# Altium project Electrolux_ENV06_387109600_RevA_PCB.PrjPCB (part 1 of 3)
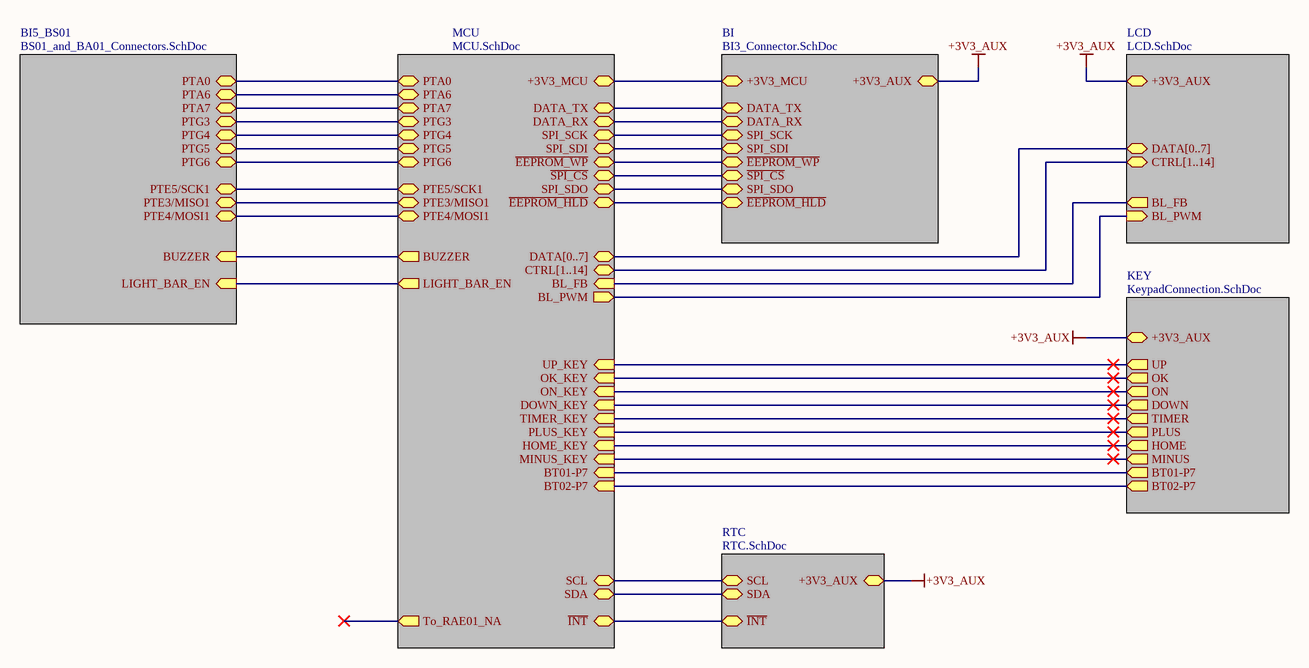
[diagram p0: Top.SchDoc]
7 sheets, 164 parts. Net scope: hierarchical (ports join the sheet entries above them; power ports are global).
Sheets:
  Top.SchDoc
    MCU = MCU.SchDoc
    BI = BI3_Connector.SchDoc
    LCD = LCD.SchDoc
    KEY = KeypadConnection.SchDoc
    RTC = RTC.SchDoc
    BI5_BS01 = BS01_and_BA01_Connectors.SchDoc

## Sheet Top.SchDoc
size A4; DocumentNumber: 1; SheetNumber: 1; SheetTotal: 7

### Sub-sheets
BI = BI3_Connector.SchDoc: DATA_TX, +3V3_MCU, +3V3_AUX, DATA_RX, SPI_SCK, SPI_SDI, ~{EEPROM_WP}, ~{SPI_CS}, SPI_SDO, ~{EEPROM_HLD}
BI5_BS01 = BS01_and_BA01_Connectors.SchDoc: PTA6 (bidir), PTA7 (bidir), PTG3 (bidir), PTG4 (bidir), PTG5 (bidir), PTG6 (bidir), PTE5/SCK1 (bidir), PTE3/MISO1 (bidir), PTE4/MOSI1 (bidir), PTA0 (bidir), LIGHT_BAR_EN (in), BUZZER (in)
KEY = KeypadConnection.SchDoc: UP (out), OK (out), ON (out), +3V3_AUX, DOWN (out), TIMER (out), PLUS (out), HOME (out), MINUS (out), BT02-P7 (out), BT01-P7 (out)
LCD = LCD.SchDoc: +3V3_AUX, BL_FB (out), BL_PWM (in), CTRL[1..14], DATA[0..7]
MCU = MCU.SchDoc: DATA_TX, DATA_RX, SPI_SCK, SPI_SDI, ~{EEPROM_WP}, ~{SPI_CS}, SPI_SDO, +3V3_MCU, UP_KEY (in), OK_KEY (in), ON_KEY (in), DOWN_KEY (in), TIMER_KEY (in), PLUS_KEY (in), HOME_KEY (in), MINUS_KEY (in), ~{EEPROM_HLD}, SCL, SDA, ~{INT}, BL_PWM (out), BL_FB (in), BT01-P7 (in), BT02-P7 (in), CTRL[1..14], DATA[0..7], LIGHT_BAR_EN (out), BUZZER (out), To_RAE01_NA (out), PTA6 (bidir), PTA7 (bidir), PTG3 (bidir), PTG4 (bidir), PTG5 (bidir), PTG6 (bidir), PTE5/SCK1 (bidir), PTE3/MISO1 (bidir), PTE4/MOSI1 (bidir), PTA0 (bidir)
RTC = RTC.SchDoc: +3V3_AUX, SCL, SDA, ~{INT}

### Nets
+3V3_AUX: sheet BI/+3V3_AUX, sheet LCD/+3V3_AUX, sheet KEY/+3V3_AUX, sheet RTC/+3V3_AUX
IRQ: sheet MCU/~{INT}, sheet RTC/~{INT}
PTA0: sheet MCU/PTA0, sheet BI5_BS01/PTA0
PTA6: sheet MCU/PTA6, sheet BI5_BS01/PTA6
PTA7: sheet MCU/PTA7, sheet BI5_BS01/PTA7
PTG3: sheet MCU/PTG3, sheet BI5_BS01/PTG3
PTG4: sheet MCU/PTG4, sheet BI5_BS01/PTG4
PTG5: sheet MCU/PTG5, sheet BI5_BS01/PTG5
PTG6: sheet MCU/PTG6, sheet BI5_BS01/PTG6
VDD: sheet MCU/+3V3_MCU, sheet BI/+3V3_MCU
NetBT01_3: sheet MCU/ON_KEY, sheet KEY/ON
NetBT01_4: sheet MCU/UP_KEY, sheet KEY/UP
NetBT01_5: sheet MCU/DOWN_KEY, sheet KEY/DOWN
NetBT01_6: sheet MCU/HOME_KEY, sheet KEY/HOME
NetBT01_7: sheet MCU/BT01-P7, sheet KEY/BT01-P7
NetBT02_3: sheet MCU/TIMER_KEY, sheet KEY/TIMER
NetBT02_4: sheet MCU/PLUS_KEY, sheet KEY/PLUS
NetBT02_5: sheet MCU/MINUS_KEY, sheet KEY/MINUS
NetBT02_6: sheet MCU/OK_KEY, sheet KEY/OK
NetBT02_7: sheet MCU/BT02-P7, sheet KEY/BT02-P7
NetCD17_1: sheet MCU/BL_FB, sheet LCD/BL_FB
NetQI02_3: sheet MCU/DATA_RX, sheet BI/DATA_RX
NetRA07_2: sheet MCU/PTE3/MISO1, sheet BI5_BS01/PTE3/MISO1
NetRA10_2: sheet MCU/PTE4/MOSI1, sheet BI5_BS01/PTE4/MOSI1
NetRA12_2: sheet MCU/PTE5/SCK1, sheet BI5_BS01/PTE5/SCK1
NetRB05_1: sheet MCU/BUZZER, sheet BI5_BS01/BUZZER
NetRD17_2: sheet MCU/BL_PWM, sheet LCD/BL_PWM
NetRI09_1: sheet MCU/DATA_TX, sheet BI/DATA_TX
NetRL02_2: sheet MCU/LIGHT_BAR_EN, sheet BI5_BS01/LIGHT_BAR_EN
NetRM01_1: sheet MCU/~{EEPROM_WP}, sheet BI/~{EEPROM_WP}
NetRM02_1: sheet MCU/~{EEPROM_HLD}, sheet BI/~{EEPROM_HLD}
NetRM03_1: sheet MCU/~{SPI_CS}, sheet BI/~{SPI_CS}
NetRM04_2: sheet MCU/SPI_SCK, sheet BI/SPI_SCK
NetRM05_2: sheet MCU/SPI_SDI, sheet BI/SPI_SDI
NetRM06_2: sheet MCU/SPI_SDO, sheet BI/SPI_SDO
NetRR01_1: sheet MCU/SDA, sheet RTC/SDA
NetRR02_1: sheet MCU/SCL, sheet RTC/SCL

### Buses and harness runs
bus sheet LCD/CTRL[1..14] = sheet MCU/CTRL[1..14]
bus sheet LCD/DATA[0..7] = sheet MCU/DATA[0..7]

### Notes on the sheet
- Title
- Size:
- Date:
- A4
- Number:
- Time:
- Revision:
- Sheet
- of
- File:

## Sheet MCU.SchDoc
size A3; DocumentNumber: 6; SheetNumber: 6; SheetTotal: 7
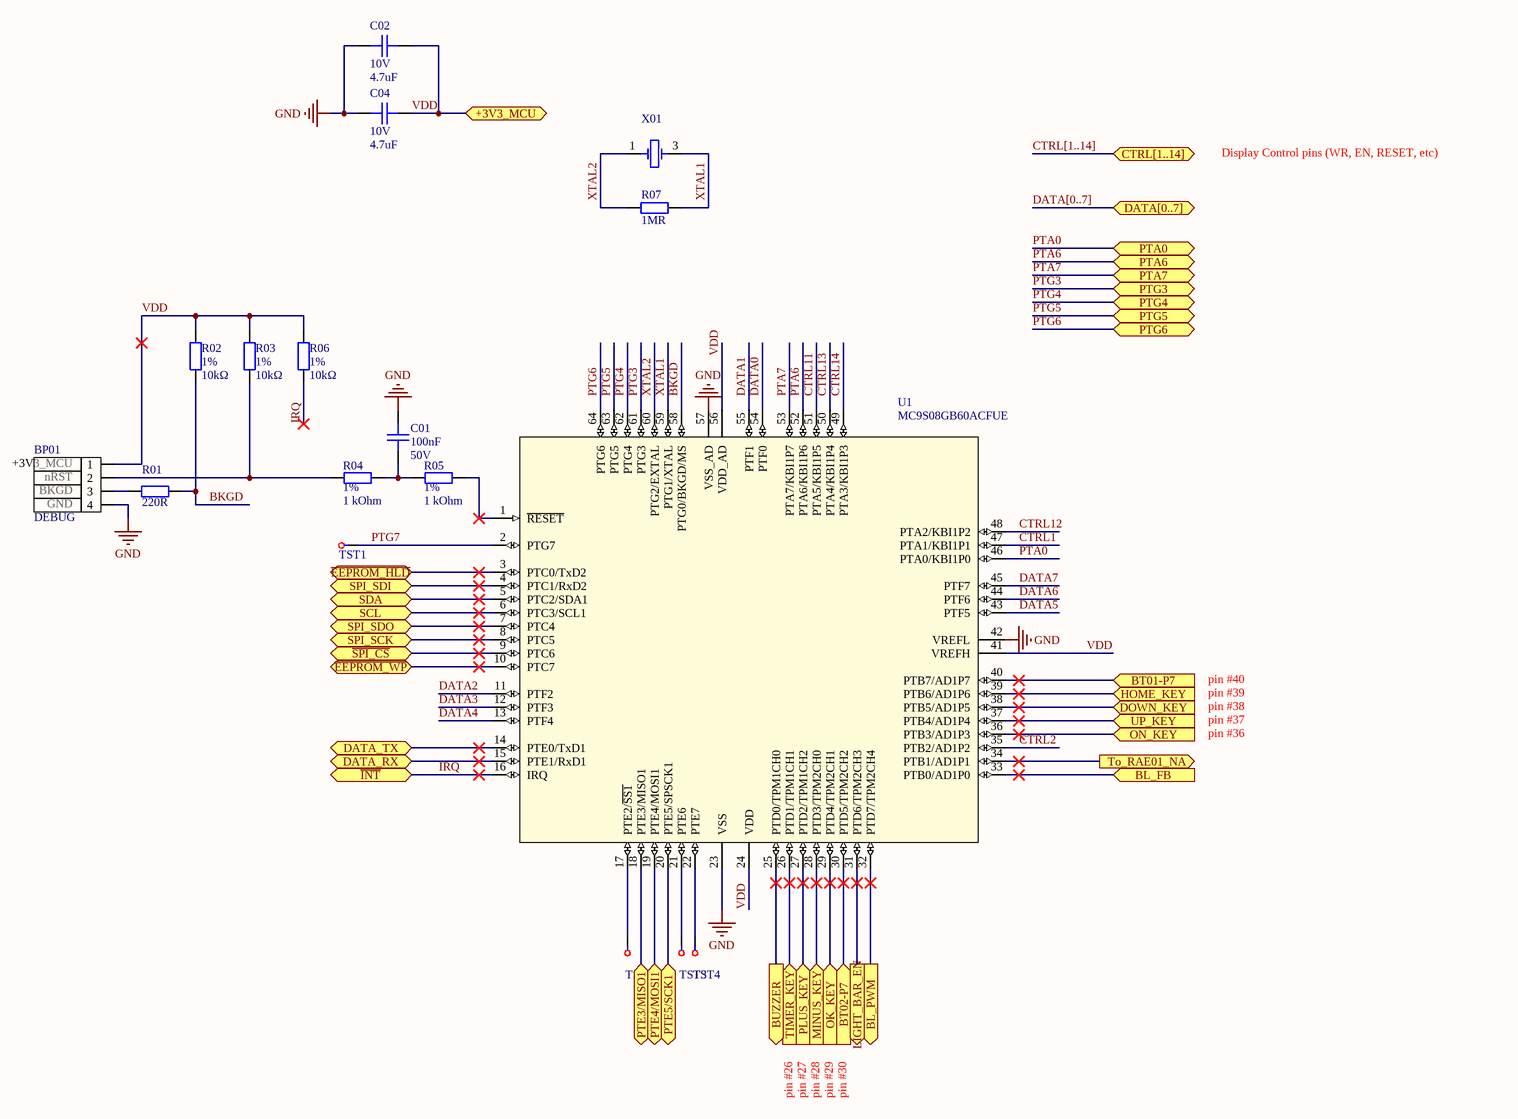
[diagram p1: MCU.SchDoc]

### Parts
BP01  DEBUG  pin_1: +3V3_MCU  pin_2: nRST  pin_3: BKGD  pin_4: GND
C01  Capacitance: 100nF  Voltage Rating: 50V  [CAPC1608X08N_0603]  (hidden comment: CAP CER 0.1uF ±10% 50V X7R 0603)
C02  Voltage Rating: 10V  Capacitance: 4.7uF  [0603C]  (hidden comment: CAP CER 4.7UF 10V X5R 0603)
C04  Voltage Rating: 10V  Capacitance: 4.7uF  [0603C]  (hidden comment: CAP CER 4.7UF 10V X5R 0603)
R01  Resistance: 220R  [Resistor-0603]  (hidden comment: R 220Ω ±1% 0603 0.1W)
R02  Tolerance: 1%  Resistance: 10kΩ  [R0603]  (hidden comment: 10 kOhms ±1% 0.1W, 1/10W Chip Resistor 0603 (1608 Metric)  Thick Film)
R03  Tolerance: 1%  Resistance: 10kΩ  [R0603]  (hidden comment: 10 kOhms ±1% 0.1W, 1/10W Chip Resistor 0603 (1608 Metric)  Thick Film)
R04  Tolerance: 1%  Resistance: 1 kOhm  [R0603]  (hidden comment: 1 kOhms ±1% 0.1W, 1/10W Chip Resistor 0603 (1608 Metric) Moisture Resistant Thick Film)  (no BOM)
R05  Tolerance: 1%  Resistance: 1 kOhm  [R0603]  (hidden comment: 1 kOhms ±1% 0.1W, 1/10W Chip Resistor 0603 (1608 Metric) Moisture Resistant Thick Film)  (no BOM)
R06  Tolerance: 1%  Resistance: 10kΩ  [R0603]  (hidden comment: 10 kOhms ±1% 0.1W, 1/10W Chip Resistor 0603 (1608 Metric)  Thick Film)
R07  Resistance: 1MR  [Resistor-0603]  (hidden comment: Resistor)
TST1  TestPoint  [Testpoint]  (value not drawn)  (no BOM)
TST2  TestPoint  [Testpoint]  (value not drawn)  (no BOM)
TST3  TestPoint  [Testpoint]  (value not drawn)  (no BOM)
TST4  TestPoint  [Testpoint]  (value not drawn)  (no BOM)
U1  MC9S08GB60ACFUE
X01  ABM11-16.000MHZ-D2X-T3  [ABM11]  (value not drawn)

### Ports
+3V3_MCU, BL_FB (in), BL_PWM (out), BT01-P7 (in), BT02-P7 (in), BUZZER (out), CTRL[1..14], DATA[0..7], DATA_RX, DATA_TX, DOWN_KEY (in), HOME_KEY (in), LIGHT_BAR_EN (out), MINUS_KEY (in), OK_KEY (in), ON_KEY (in), PLUS_KEY (in), PTA0 (bidir), PTA6 (bidir), PTA7 (bidir), PTE3/MISO1 (bidir), PTE4/MOSI1 (bidir), PTE5/SCK1 (bidir), PTG3 (bidir), PTG4 (bidir), PTG5 (bidir), PTG6 (bidir), SCL, SDA, SPI_SCK, SPI_SDI, SPI_SDO, TIMER_KEY (in), To_RAE01_NA (out), UP_KEY (in), ~{EEPROM_HLD}, ~{EEPROM_WP}, ~{INT}, ~{SPI_CS}

### Nets
D_GND: X01.2(GND) X01.4(GND)
GND: BP01.4 C01.2 C02.1 C04.1 U1.23(VSS) U1.42(VREFL) U1.57(VSS_AD)
BKGD: R01.2 R02.1 U1.58(PTG0/BKGD/MS)
CTRL1: U1.47(PTA1/KBI1P1)
CTRL2: U1.35(PTB2/AD1P2)
CTRL11: U1.51(PTA5/KBI1P5)
CTRL12: U1.48(PTA2/KBI1P2)
CTRL13: U1.50(PTA4/KBI1P4)
CTRL14: U1.49(PTA3/KBI1P3)
DATA0: U1.54(PTF0)
DATA1: U1.55(PTF1)
DATA2: U1.11(PTF2)
DATA3: U1.12(PTF3)
DATA4: U1.13(PTF4)
DATA5: U1.43(PTF5)
DATA6: U1.44(PTF6)
DATA7: U1.45(PTF7)
IRQ: R06.1 U1.16(IRQ) ; port ~{INT}
PTA0: U1.46(PTA0/KBI1P0) ; port PTA0
PTA6: U1.52(PTA6/KBI1P6) ; port PTA6
PTA7: U1.53(PTA7/KBI1P7) ; port PTA7
PTG3: U1.61(PTG3) ; port PTG3
PTG4: U1.62(PTG4) ; port PTG4
PTG5: U1.63(PTG5) ; port PTG5
PTG6: U1.64(PTG6) ; port PTG6
PTG7: TST1.1 U1.2(PTG7)
VDD: BP01.1 C02.2 C04.2 R02.2 R03.2 R06.2 U1.24(VDD) U1.41(VREFH) U1.56(VDD_AD) ; port +3V3_MCU
XTAL1: R07.2 U1.59(PTG1/XTAL) X01.3(OSC2)
XTAL2: R07.1 U1.60(PTG2/EXTAL) X01.1(OSC1)
NetBP01_2: BP01.2 R03.1 R04.1
NetBP01_3: BP01.3 R01.1
NetBT01_3: U1.36(PTB3/AD1P3) ; port ON_KEY
NetBT01_4: U1.37(PTB4/AD1P4) ; port UP_KEY
NetBT01_5: U1.38(PTB5/AD1P5) ; port DOWN_KEY
NetBT01_6: U1.39(PTB6/AD1P6) ; port HOME_KEY
NetBT01_7: U1.40(PTB7/AD1P7) ; port BT01-P7
NetBT02_3: U1.26(PTD1/TPM1CH1) ; port TIMER_KEY
NetBT02_4: U1.27(PTD2/TPM1CH2) ; port PLUS_KEY
NetBT02_5: U1.28(PTD3/TPM2CH0) ; port MINUS_KEY
NetBT02_6: U1.29(PTD4/TPM2CH1) ; port OK_KEY
NetBT02_7: U1.30(PTD5/TPM2CH2) ; port BT02-P7
NetC01_1: C01.1 R04.2 R05.1
NetCD17_1: U1.33(PTB0/AD1P0) ; port BL_FB
NetQI02_3: U1.15(PTE1/RxD1) ; port DATA_RX
NetR05_2: R05.2 U1.1(~{RESET})
NetRA07_2: U1.18(PTE3/MISO1) ; port PTE3/MISO1
NetRA10_2: U1.19(PTE4/MOSI1) ; port PTE4/MOSI1
NetRA12_2: U1.20(PTE5/SPSCK1) ; port PTE5/SCK1
NetRB05_1: U1.25(PTD0/TPM1CH0) ; port BUZZER
NetRD17_2: U1.32(PTD7/TPM2CH4) ; port BL_PWM
NetRI09_1: U1.14(PTE0/TxD1) ; port DATA_TX
NetRL02_2: U1.31(PTD6/TPM2CH3) ; port LIGHT_BAR_EN
NetRM01_1: U1.10(PTC7) ; port ~{EEPROM_WP}
NetRM02_1: U1.3(PTC0/TxD2) ; port ~{EEPROM_HLD}
NetRM03_1: U1.9(PTC6) ; port ~{SPI_CS}
NetRM04_2: U1.8(PTC5) ; port SPI_SCK
NetRM05_2: U1.4(PTC1/RxD2) ; port SPI_SDI
NetRM06_2: U1.7(PTC4) ; port SPI_SDO
NetRR01_1: U1.5(PTC2/SDA1) ; port SDA
NetRR02_1: U1.6(PTC3/SCL1) ; port SCL
NetTST2_1: TST2.1 U1.17(PTE2/~{SS1})
NetTST3_1: TST3.1 U1.21(PTE6)
NetTST4_1: TST4.1 U1.22(PTE7)
NetU1_34: U1.34(PTB1/AD1P1) ; port To_RAE01_NA

### Buses and harness runs
bus CTRL[1..14] = port CTRL[1..14]
bus DATA[0..7] = port DATA[0..7]

### Notes on the sheet
- Display Control pins (WR, EN, RESET, etc)
- pin #40
- pin #39
- pin #38
- pin #37
- pin #36
- pin #26
- pin #27
- pin #28
- pin #29
- pin #30
- Title
- Size:
- Date:
- A3
- Number:
- Time:
- Revision:
- Sheet
- of
- File:

### Library data of the parts
BP01 = CONN HEADER 4POS
C01 = CAP CER 0.1uF ±10% 50V X7R 0603: Capacitor; Manufacturer: KEMET; Manufacturer Part Number: C0603C104M5RACTU; Dielectric Material: Ceramic; Tolerance: 20%; Dissipation Factor: 2.5%; Supplier 1: Digi-Key; Stock 1: 1202175; Pricing 1: 1=0.1, 10=0.039, 50=0.0204, 100=0.0174, 500=0.0124, 1000=0.0097 (USD); Mount: Surface Mount,PCB; Case/Package: 0603; Case Code (Metric): 1608; Case Code (Imperial): 0603; Contact Plating: Tin,Matte; Min Operating Temperature: -55°C; Max Operating Temperature: 125°C; Package Quantity: 1; Packaging: Tape and Reel; Voltage Rating (DC): 50V; Dielectric: X7R; Termination: SMD/SMT; Length: 1.6mm; Height: 0.8mm; Width: 0.031inch; Thickness: 0.034inch; Lead Pitch: 0.7mm; Depth: 0.8mm; Radiation Hardening: No; REACH SVHC: No SVHC; ComponentLink1URL: http://www.farnell.com/datasheets/2746056.pdf?src-supplier=Element14; ComponentLink1Description: http://www.farnell.com/datasheets/2746056.pdf?src-supplier=Element14; ComponentLink2URL: http://www.mouser.com/ds/2/212/KEM_C1002_X7R_SMD-1102033.pdf?src-supplier=Mouser; ComponentLink2Description: http://www.mouser.com/ds/2/212/KEM_C1002_X7R_SMD-1102033.pdf?src-supplier=Mouser; ComponentLink3URL: https://www.verical.com/server-webapp/html/getDatasheet?partID=626892&src-supplier=Verical; ComponentLink3Description: https://www.verical.com/server-webapp/html/getDatasheet?partID=626892&src-supplier=Verical; ComponentLink4URL: http://components.arrow.com/part/dataview/40911037S8853915N7429?src-supplier=Arrow; ComponentLink4Description: http://components.arrow.com/part/dataview/40911037S8853915N7429?src-supplier=Arrow; ComponentLink5URL: http://capacitoredge.kemet.com/capedge2/DataSheet?pn=C0603C104M5RAC7867&src-supplier=Avnet; ComponentLink5Description: http://capacitoredge.kemet.com/capedge2/DataSheet?pn=C0603C104M5RAC7867&src-supplier=Avnet; ComponentLink6URL: http://capacitoredge.kemet.com/capedge2/DataSheet?pn=C0603C104M5RAC7867&src-supplier=Avnet+Asia; ComponentLink6Description: http://capacitoredge.kemet.com/capedge2/DataSheet?pn=C0603C104M5RAC7867&src-supplier=Avnet+Asia; ComponentLink7URL: http://www.farnell.com/datasheets/2746056.pdf?src-supplier=Farnell; ComponentLink7Description: http://www.farnell.com/datasheets/2746056.pdf?src-supplier=Farnell; ComponentLink8URL: http://www.farnell.com/datasheets/2746056.pdf?src-supplier=Newark; ComponentLink8Description: http://www.farnell.com/datasheets/2746056.pdf?src-supplier=Newark; ComponentLink9URL: http://www.alliedelec.com/m/d/6f3b5eb83d09db50ed28bdc730567b33.pdf?src-supplier=Allied+Electronics; ComponentLink9Description: http://www.alliedelec.com/m/d/6f3b5eb83d09db50ed28bdc730567b33.pdf?src-supplier=Allied+Electronics; ComponentLink10URL: https://api.kemet.com/component-edge/download/datasheet/C0603C104M5RACTU.pdf?src-supplier=Digi-Key; ComponentLink10Description: https://api.kemet.com/component-edge/download/datasheet/C0603C104M5RACTU.pdf?src-supplier=Digi-Key; ComponentLink11URL: http://www.farnell.com/datasheets/2315113.pdf?src-supplier=Newark; ComponentLink11Description: http://www.farnell.com/datasheets/2315113.pdf?src-supplier=Newark; ComponentLink12URL: http://www.farnell.com/datasheets/1828800.pdf?src-supplier=Newark; ComponentLink12Description: http://www.farnell.com/datasheets/1828800.pdf?src-supplier=Newark; ComponentLink13URL: http://components.arrow.com/part/dataview/0323_00313986?src-supplier=Arrow+Europe; ComponentLink13Description: http://components.arrow.com/part/dataview/0323_00313986?src-supplier=Arrow+Europe; ComponentLink14URL: https://www.verical.com/server-webapp/html/getDatasheet?partID=110138&src-supplier=Verical; ComponentLink14Description: https://www.verical.com/server-webapp/html/getDatasheet?partID=110138&src-supplier=Verical; Supplier Part Number 1: 399-7845-1-ND
C02 C04 = CAP CER 4.7UF 10V X5R 0603: 4.7µF ±10% 10V Ceramic Capacitor X5R 0603 (1608 Metric); Manufacturer: Yageo; Manufacturer Part Number: CC0603KRX5R6BB475; Supplier 1: Digi-Key; Stock 1: 325858; Pricing 1: 1=0.26, 10=0.18, 100=0.102, 500=0.072, 1000=0.063 (USD); Mount: Surface Mount; Case Code (Imperial): 0603; Case Code (Metric): 1608; Min Operating Temperature: -55°C; Max Operating Temperature: 85°C; Voltage Rating (DC): 10V; Tolerance: 10%; Packaging: Tape and Reel; Package Quantity: 1; Dielectric: X5R; Termination: SMD/SMT; Composition: Ceramic; Length: 1.6mm; Height: 0.8mm; Width: 0.8mm; Thickness: 0.035inch; Depth: 0.8mm; Radiation Hardening: No; REACH SVHC: Unknown; Lead Free: Lead Free; Halogen Free: Halogen Free; ComponentLink1URL: http://www.farnell.com/datasheets/2167237.pdf?src-supplier=Element14; ComponentLink1Description: http://www.farnell.com/datasheets/2167237.pdf?src-supplier=Element14; ComponentLink2URL: http://www.yageo.com/documents/recent/UPY-GPHC_X5R_4V-to-50V_25.pdf?src-supplier=Digi-Key; ComponentLink2Description: http://www.yageo.com/documents/recent/UPY-GPHC_X5R_4V-to-50V_25.pdf?src-supplier=Digi-Key; ComponentLink3URL: http://www.yageo.com/documents/recent/UPY-GPHC_X5R_4V-to-50V_12.pdf?src-supplier=Avnet; ComponentLink3Description: http://www.yageo.com/documents/recent/UPY-GPHC_X5R_4V-to-50V_12.pdf?src-supplier=Avnet; ComponentLink4URL: http://www.yageo.com/documents/recent/UPY-GPHC_X5R_4V-to-50V_12.pdf?src-supplier=Avnet+Europe; ComponentLink4Description: http://www.yageo.com/documents/recent/UPY-GPHC_X5R_4V-to-50V_12.pdf?src-supplier=Avnet+Europe; Supplier Part Number 1: 311-1455-1-ND; Case/Package: 0603
R01 = R 220Ω ±1% 0603 0.1W: Resistor; Manufacturer: Stackpole Electronics; Manufacturer Part Number: RMCF0603FT220R; Power Rating: 100mW; Temperature Coefficient: 100ppm/°C; Supplier 1: Digi-Key; Stock 1: 79747; Pricing 1: 1=0.1, 10=0.016, 100=0.0065, 1000=0.0029, 2500=0.0025 (USD); Mount: Surface Mount; Case/Package: 0603; Case Code (Metric): 1608; Case Code (Imperial): 0603; Contact Plating: Tin,Matte; Min Operating Temperature: -55°C; Max Operating Temperature: 155°C; Packaging: Tape and Reel; Composition: Thick Film; Number of Terminations: 2; Max Power Dissipation: 100mW; Features: Automotive AEC-Q200; Length: 0.061inch; Height: 0.022inch; Width: 0.031inch; Radiation Hardening: No; Lead Free: Lead Free; ComponentLink1URL: http://components.arrow.com/part/dataview/50498833S229663N1174?src-supplier=Arrow; ComponentLink1Description: http://components.arrow.com/part/dataview/50498833S229663N1174?src-supplier=Arrow; ComponentLink2URL: https://www.seielect.com/catalog/SEI-Packaging.pdf?src-supplier=Digi-Key; ComponentLink2Description: https://www.seielect.com/catalog/SEI-Packaging.pdf?src-supplier=Digi-Key; ComponentLink3URL: http://www.seielect.com/Catalog/SEI-RMC.pdf?src-supplier=Future+Electronics; ComponentLink3Description: http://www.seielect.com/Catalog/SEI-RMC.pdf?src-supplier=Future+Electronics; ComponentLink4URL: https://www.seielect.com/catalog/SEI-RMCF_RMCP.pdf?src-supplier=Avnet; ComponentLink4Description: https://www.seielect.com/catalog/SEI-RMCF_RMCP.pdf?src-supplier=Avnet; Supplier Part Number 1: RMCF0603FT220RCT-ND; Tolerance: 1%
R02 R03 R06 = RES SMD 10K OHM 1% 1/10W 0603: Manufacturer: Yageo; Manufacturer Part Number: RC0603FR-0710KL; Temperature Coefficient: 100ppm/°C; Power Rating: 100mW; Voltage Rating: 75V; Voltage Rating (DC): 50V; Supplier 1: Digi-Key; Stock 1: 81498627; Pricing 1: 1=0.1, 10=0.024, 100=0.0097, 1000=0.0044, 2500=0.0038 (USD); Case Code (Imperial): 0603; Case Code (Metric): 1608; Min Operating Temperature: -55°C; Max Operating Temperature: 155°C; Composition: Thick Film; Packaging: Tape and Reel; Termination: SMD/SMT; Military Standard: Not; Length: 1.6mm; Height: 0.45mm; Depth: 0.8mm; REACH SVHC: No SVHC; Lead Free: Lead Free; ComponentLink1URL: http://www.farnell.com/datasheets/38590.pdf?src-supplier=Element14; ComponentLink1Description: http://www.farnell.com/datasheets/38590.pdf?src-supplier=Element14; ComponentLink2URL: https://www.verical.com/server-webapp/html/getDatasheet?partID=409289&src-supplier=Verical; ComponentLink2Description: https://www.verical.com/server-webapp/html/getDatasheet?partID=409289&src-supplier=Verical; ComponentLink3URL: http://www.farnell.com/datasheets/1868787.pdf?src-supplier=Element14; ComponentLink3Description: http://www.farnell.com/datasheets/1868787.pdf?src-supplier=Element14; ComponentLink4URL: http://www.farnell.com/datasheets/2167052.pdf?src-supplier=Element14; ComponentLink4Description: http://www.farnell.com/datasheets/2167052.pdf?src-supplier=Element14; ComponentLink5URL: http://www.farnell.com/datasheets/443971.pdf?src-supplier=Element14; ComponentLink5Description: http://www.farnell.com/datasheets/443971.pdf?src-supplier=Element14; Supplier Part Number 1: 311-10.0KHRCT-ND; Case/Package: 0603; Number of Pins: 2; Weight: 7.1E-05oz; Width: 0.8mm; Lead Pitch: 0.3mm
R04 R05 = RES SMD 1K OHM 1% 1/10W 0603: Manufacturer: Yageo; Manufacturer Part Number: RC0603FR-071KL; Temperature Coefficient: 100ppm/°C; Power Rating: 100mW; Voltage Rating: 50V; Supplier 1: Digi-Key; Stock 1: 39344753; Pricing 1: 1=0.1, 10=0.023, 100=0.0094, 1000=0.0042, 2500=0.0037 (USD); Contact Plating: Tin,Matte; Case Code (Imperial): 0603; Case Code (Metric): 1608; Min Operating Temperature: -55°C; Max Operating Temperature: 155°C; Composition: Thick Film; Packaging: Tape and Reel; Termination: SMD/SMT; Military Standard: Not; Length: 1.6mm; Height: 0.45mm; Depth: 0.8mm; Radiation Hardening: No; REACH SVHC: No SVHC; Lead Free: Lead Free; ComponentLink1URL: http://documents.rs-components.com/techlib://itc_doclist_GB.htm?stockno=5048928&src-supplier=RSComponents; ComponentLink1Description: http://documents.rs-components.com/techlib://itc_doclist_GB.htm?stockno=5048928&src-supplier=RSComponents; ComponentLink2URL: http://www.yageo.com/documents/recent/PYu-RC0603_51_RoHS_L_4.pdf?src-supplier=Avnet+Europe; ComponentLink2Description: http://www.yageo.com/documents/recent/PYu-RC0603_51_RoHS_L_4.pdf?src-supplier=Avnet+Europe; ComponentLink3URL: http://www.farnell.com/datasheets/2167052.pdf?src-supplier=Element14; ComponentLink3Description: http://www.farnell.com/datasheets/2167052.pdf?src-supplier=Element14; ComponentLink4URL: http://www.farnell.com/datasheets/1868787.pdf?src-supplier=Element14; ComponentLink4Description: http://www.farnell.com/datasheets/1868787.pdf?src-supplier=Element14; ComponentLink5URL: http://www.yageo.com/documents/recent/PYu-RC_Group_51_RoHS_L_2.pdf?src-supplier=Avnet; ComponentLink5Description: http://www.yageo.com/documents/recent/PYu-RC_Group_51_RoHS_L_2.pdf?src-supplier=Avnet; ComponentLink6URL: https://www.verical.com/server-webapp/html/getDatasheet?partID=404327&src-supplier=Verical; ComponentLink6Description: https://www.verical.com/server-webapp/html/getDatasheet?partID=404327&src-supplier=Verical; ComponentLink7URL: http://www.farnell.com/datasheets/443971.pdf?src-supplier=Element14; ComponentLink7Description: http://www.farnell.com/datasheets/443971.pdf?src-supplier=Element14; Supplier Part Number 1: 311-1.00KHRDKR-ND; Case/Package: 0603
R07 = R 1MΩ ±5% 0603 0.1W: Manufacturer: Stackpole Electronics; Manufacturer Part Number: RMCF0603FG1M00; Temperature Coefficient: 100ppm/°C; Tolerance: 1%; Max Power Dissipation: 100mW; Supplier 1: Digi-Key; Stock 1: 429298; Pricing 1: 1=0.1, 10=0.016, 100=0.0065, 1000=0.0029, 2500=0.0025, 5000=0.0021 (USD); Contact Plating: Tin,Matte; Case Code (Imperial): 0603; Case Code (Metric): 1608; Min Operating Temperature: -55°C; Max Operating Temperature: 155°C; Composition: Thick Film; Packaging: Tape and Reel; Length: 0.061inch; Height: 0.022inch; Radiation Hardening: No; Lead Free: Contains Lead; ComponentLink1URL: https://www.seielect.com/catalog/SEI-Packaging.pdf?src-supplier=Digi-Key; ComponentLink1Description: https://www.seielect.com/catalog/SEI-Packaging.pdf?src-supplier=Digi-Key; ComponentLink2URL: https://www.seielect.com/catalog/SEI-RMCF_RMCP.pdf?src-supplier=Avnet; ComponentLink2Description: https://www.seielect.com/catalog/SEI-RMCF_RMCP.pdf?src-supplier=Avnet; ComponentLink3URL: https://www.seielect.com/Catalog/SEI-RMCF_RMCP.pdf?src-supplier=Digi-Key; ComponentLink3Description: https://www.seielect.com/Catalog/SEI-RMCF_RMCP.pdf?src-supplier=Digi-Key; Supplier Part Number 1: RMCF0603FG1M00CT-ND; Case/Package: 0603; Mount: Surface Mount; Package Quantity: 1; Number of Terminations: 2; Features: Automotive AEC-Q200; Width: 0.031inch
TST1-TST4 = TestPoint: Test Point. There is nothing to buy or mount.; ClassName: TestPoint; CompType: TestPoint; Manufacturer: N/A; MountType: N/A; PackageReference: TetsPoint; PartNumber: N/A
U1 = IC MC9S08GB60ACFUE MCU 8BIT 60KB FLASH 64LQFP: Manufacturer: NXP Freescale; RAM Size: 4KB; Frequency: 40MHz; Memory Size: 60KB; Number of Bits: 8; Core Architecture: S08; Interface: I2C,SPI,SCI; Number of I/Os: 56; Max Supply Voltage: 3.6V; Min Supply Voltage: 1.8V; Data Bus Width: 8b; Oscillator Type: Internal; Memory Type: FLASH; Watchdog Timer: Yes; Peripherals: PWM,I2C,POR,WDT,LVD; Operating Supply Voltage: 3.3V; Number of UART Channels: 2; Number of SPI Channels: 1; Supplier 1: Digi-Key; Manufacturer Part Number: MC9S08GB60ACFUE; Stock 1: 0; Pricing 1: 1=16.16, 10=16.002 (USD); Mount: Surface Mount; Case/Package: LQFP; Number of Pins: 64; Contact Plating: Tin,Matte; Min Operating Temperature: -40°C; Max Operating Temperature: 85°C; Packaging: Tray; Density: 60KB; Number of Timers/Counters: 8; Number of Programmable I/O: 56; Max Frequency: 40MHz; Package Quantity: 160; Number of PWM Channels: 8; Number of ADC Channels: 8; Number of I2C Channels: 1; Termination: SMD/SMT; Length: 10mm; Width: 10mm; Height: 1.4mm; Radiation Hardening: No; REACH SVHC: No SVHC; RoHS Compliant: Yes; ComponentLink1URL: http://www.jameco.com/Jameco/Products/ProdDS/1035379.pdf?src-supplier=Jameco; ComponentLink1Description: http://www.jameco.com/Jameco/Products/ProdDS/1035379.pdf?src-supplier=Jameco; ComponentLink2URL: http://www.farnell.com/datasheets/1844091.pdf?src-supplier=Element14; ComponentLink2Description: http://www.farnell.com/datasheets/1844091.pdf?src-supplier=Element14; ComponentLink3URL: http://www.farnell.com/datasheets/72141.pdf?src-supplier=Farnell; ComponentLink3Description: http://www.farnell.com/datasheets/72141.pdf?src-supplier=Farnell; ComponentLink4URL: http://www.freescale.com/files/microcontrollers/doc/data_sheet/MC9S08GB60A.pdf?src-supplier=Future+Electronics; ComponentLink4Description: http://www.freescale.com/files/microcontrollers/doc/data_sheet/MC9S08GB60A.pdf?src-supplier=Future+Electronics; ComponentLink5URL: http://www.produktinfo.conrad.com/datenblaetter/1100000-1199999/001183148-da-01-en-IC_MCU_60K_F_MC9S08GB60ACFUE_LQFP_64_FRE.pdf?src-supplier=Conrad; ComponentLink5Description: http://www.produktinfo.conrad.com/datenblaetter/1100000-1199999/001183148-da-01-en-IC_MCU_60K_F_MC9S08GB60ACFUE_LQFP_64_FRE.pdf?src-supplier=Conrad; ComponentLink6URL: http://datasheet.iiic.cc/freescale_semiconductor/MC9S08GB60ACFUE.pdf?src-supplier=IIIC; ComponentLink6Description: http://datasheet.iiic.cc/freescale_semiconductor/MC9S08GB60ACFUE.pdf?src-supplier=IIIC; Supplier Part Number 1: MC9S08GB60ACFUE-ND
X01 = CRYSTAL_16.0000MHZ_10PF_SMD: 16MHz ±20ppm 10pF 150 Ohms 4-SMD; Manufacturer: Abracon LLC; Digi-KeyPartNumber: 535-12629-1-ND; PartNumber: ABM11-16.000MHZ-D2X-T3; Link: https://www.digikey.com/products/en?keywords=535-12629-1-ND

## Sheet BI3_Connector.SchDoc
size A4; DocumentNumber: 2; SheetNumber: 2; SheetTotal: 7
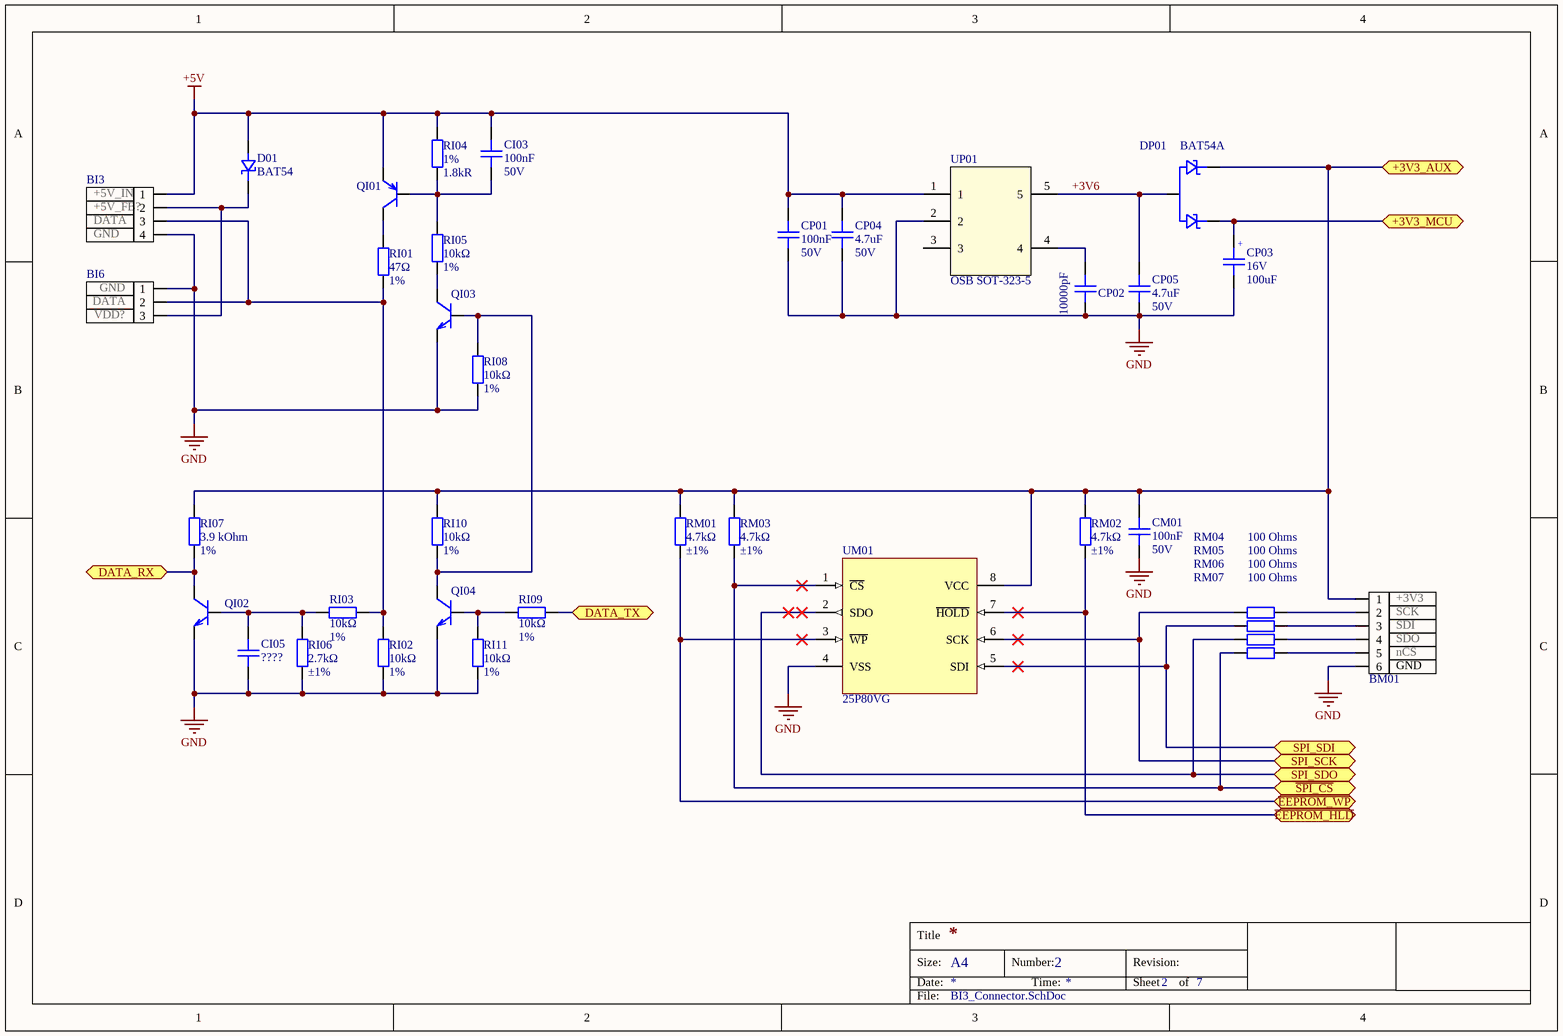
[diagram p2: BI3_Connector.SchDoc]

### Parts
BI3  pin_1: +5V_IN  pin_2: +5V_FB?  pin_3: DATA  pin_4: GND
BI6  pin_1: GND  pin_2: DATA  pin_3: VDD?  [CONN_S3B-ZR_JST]
BM01  pin_1: +3V3  pin_2: SCK  pin_3: SDI  pin_4: SDO  pin_5: nCS  pin_6: GND
CI03  Capacitance: 100nF  Voltage Rating: 50V  [CAPC1608X08N_0603]  (hidden comment: CAP CER 0.1uF ±10% 50V X7R 0603)
CI05  value ????  [CAP_0603]  (hidden comment: CC0603KRX7R0BB103)
CM01  Capacitance: 100nF  Voltage Rating: 50V  [CAPC1608X08N_0603]  (hidden comment: CAP CER 0.1uF ±10% 50V X7R 0603)
CP01  Capacitance: 100nF  Voltage Rating: 50V  [CAPC1608X08N_0603]  (hidden comment: CAP CER 0.1uF ±10% 50V X7R 0603)
CP02  value 10000pF  [CAP_0603]  (hidden comment: CC0603KRX7R0BB103)
CP03  Voltage Rating: 16V  Capacitance: 100uF  [WCAP-ASLI_5x5.5]  (hidden comment: CAP ALUM 100 UF 20% 6.3 V SMD)
CP04  Capacitance: 4.7uF  Voltage Rating: 50V  [CAPC2012X14N]  (hidden comment: CAP CER 4.7UF 50V X5R 0805)
CP05  Capacitance: 4.7uF  Voltage Rating: 50V  [CAPC2012X14N]  (hidden comment: CAP CER 4.7UF 50V X5R 0805)
D01  BAT54  [SOT100P240X120-3N]
DP01  BAT54A  [SOT100P240X120-3N]
QI01  (no value)
QI02  BC847CW,115  [SOT-323]  (value not drawn)
QI03  BC847CW,115  [SOT-323]  (value not drawn)
QI04  BC847CW,115  [SOT-323]  (value not drawn)
RI01  Resistance: 47Ω  Tolerance: 1%  [Resistor-0603]  (hidden comment: R 47Ω ±1% 0603 0.1W)
RI02  Resistance: 10kΩ  Tolerance: 1%  [R0603]  (hidden comment: RES SMD 10K OHM 1% 1/10W 0603)
RI03  Resistance: 10kΩ  Tolerance: 1%  [R0603]  (hidden comment: RES SMD 10K OHM 1% 1/10W 0603)
RI04  Tolerance: 1%  Resistance: 1.8kR  [R0603]  (hidden comment: RES SMD 1.47K OHM 1% 1/10W 0603)
RI05  Resistance: 10kΩ  Tolerance: 1%  [R0603]  (hidden comment: RES SMD 10K OHM 1% 1/10W 0603)
RI06  Resistance: 2.7kΩ  Tolerance: ±1%  [Resistor-0603]  (hidden comment: R 2.2kΩ ±1% 0603 0.1W)
RI07  Resistance: 3.9 kOhm  Tolerance: 1%  [R0603]  (hidden comment: RES SMD 7.5K OHM 1% 1/10W 0603)
RI08  Resistance: 10kΩ  Tolerance: 1%  [R0603]  (hidden comment: RES SMD 10K OHM 1% 1/10W 0603)
RI09  Resistance: 10kΩ  Tolerance: 1%  [R0603]  (hidden comment: RES SMD 10K OHM 1% 1/10W 0603)
RI10  Resistance: 10kΩ  Tolerance: 1%  [R0603]  (hidden comment: RES SMD 10K OHM 1% 1/10W 0603)
RI11  Resistance: 10kΩ  Tolerance: 1%  [R0603]  (hidden comment: RES SMD 10K OHM 1% 1/10W 0603)
RM01  Resistance: 4.7kΩ  Tolerance: ±1%  [Resistor-0603]
RM02  Resistance: 4.7kΩ  Tolerance: ±1%  [Resistor-0603]
RM03  Resistance: 4.7kΩ  Tolerance: ±1%  [Resistor-0603]
RM04  100 Ohms  [R_0603]
RM05  100 Ohms  [R_0603]
RM06  100 Ohms  [R_0603]
RM07  100 Ohms  [R_0603]
UM01  25P80VG
UP01  OSB SOT-323-5

### Ports
+3V3_AUX, +3V3_MCU, DATA_RX, DATA_TX, SPI_SCK, SPI_SDI, SPI_SDO, ~{EEPROM_HLD}, ~{EEPROM_WP}, ~{SPI_CS}

### Nets
+3V3_AUX: BM01.1 CM01.2 DP01.2 RI07.1 RI10.1 RM01.2 RM02.2 RM03.2 UM01.8(VCC) ; port +3V3_AUX
+5V: BI3.1 CI03.2 CP01.2 CP04.2 D01.1 QI01.2(E) RI04.2 UP01.1
GND: BI3.4 BI6.1 BM01.6 CI05.1 CM01.1 CP01.1 CP02.1 CP03.2 CP04.1 CP05.1 QI02.2(E) QI03.2(E) QI04.2(E) RI02.1 RI06.2 RI08.1 RI11.1 UM01.4(VSS) UP01.2
+3V6: CP05.2 DP01.3 UP01.5
VDD: CP03.1 DP01.1 ; port +3V3_MCU
NetBI3_2: BI3.2 BI6.3 D01.3
NetBI3_3: BI3.3 BI6.2 RI01.1 RI02.2 RI03.2
NetBM01_2: BM01.2 RM04.1
NetBM01_3: BM01.3 RM05.1
NetBM01_4: BM01.4 RM06.1
NetBM01_5: BM01.5 RM07.1
NetCI03_1: CI03.1 QI01.1(B) RI04.1 RI05.2
NetCI05_2: CI05.2 QI02.1(B) RI03.1 RI06.1
NetCP02_2: CP02.2 UP01.4
NetQI01_3: QI01.3(C) RI01.2
NetQI02_3: QI02.3(C) RI07.2 ; port DATA_RX
NetQI03_1: QI03.1(B) QI04.3(C) RI08.2 RI10.2
NetQI03_3: QI03.3(C) RI05.1
NetQI04_1: QI04.1(B) RI09.2 RI11.2
NetRI09_1: RI09.1 ; port DATA_TX
NetRM01_1: RM01.1 UM01.3(~{WP}) ; port ~{EEPROM_WP}
NetRM02_1: RM02.1 UM01.7(~{HOLD}) ; port ~{EEPROM_HLD}
NetRM03_1: RM03.1 RM07.2 UM01.1(~{CS}) ; port ~{SPI_CS}
NetRM04_2: RM04.2 UM01.6(SCK) ; port SPI_SCK
NetRM05_2: RM05.2 UM01.5(SDI) ; port SPI_SDI
NetRM06_2: RM06.2 UM01.2(SDO) ; port SPI_SDO

Not connected (* = marked no-connect by the designer): UP01 3

### Notes on the sheet
- Title
- Size:
- Date:
- A4
- Number:
- Time:
- Revision:
- Sheet
- of
- File:
- (in symbol CAP ALUM 100 UF 20% 6.3 V SMD) +

### Library data of the parts
BI3 = CONN HEADER R/A 4POS 2MM: Connector Header Through Hole, Right Angle 4 position 0.079" (2.00mm); Manufacturer: Molex; Manufacturer Part Number: 53254-0470; Gender: Male; Current Rating: 2A; Voltage Rating: 125V; Number of Contacts: 4; Pitch: 2mm; Glow Wire Compliant: Non-compliant; Supplier 1: Digi-Key; Stock 1: 2306; Pricing 1: 1=0.28, 10=0.259, 100=0.1794, 500=0.1518, 1000=0.1242, 5000=0.1104, 10000=0.1001 (USD); Mount: Through Hole; Contact Plating: Tin; Contact Material: Brass; Housing Material: Nylon; Color: Natural; Min Operating Temperature: -40°C; Max Operating Temperature: 105°C; Packaging: Tray; Termination: Through Hole; Number of Rows: 1; Package Quantity: 2000; Number of Positions: 4; Orientation: Right Angle; Voltage Rating (DC): 125V; Number of Circuits: 4; Radiation Hardening: No; REACH SVHC: Unknown; Flammability Rating: UL94 V-0; ComponentLink1URL: http://www.molex.com/webdocs/datasheets/pdf/en-us/0532540470_PCB_HEADERS.pdf?src-supplier=Avnet+Europe; ComponentLink1Description: http://www.molex.com/webdocs/datasheets/pdf/en-us/0532540470_PCB_HEADERS.pdf?src-supplier=Avnet+Europe; ComponentLink2URL: http://www.mouser.com/ds/2/276/0532540470_PCB_HEADERS-229262.pdf?src-supplier=Mouser; ComponentLink2Description: http://www.mouser.com/ds/2/276/0532540470_PCB_HEADERS-229262.pdf?src-supplier=Mouser; Supplier Part Number 1: WM19001-ND
BI6 = CONN HEADER TH R/A 3POS 1.5MM: Connector Header Through Hole, Right Angle 3 position 0.059" (1.50mm); Manufacturer: JST; Manufacturer Part Number: S3B-ZR(LF)(SN); Body Plating: Tin; Current Rating: 1A; Contact Resistance: 30mR; Voltage Rating: 50V; Number of Positions: 3; Gender: Male; Connector Type: Male Pin; Insulation Resistance: 500MR; Pitch: 1.5mm; Panel Thickness: 3.5mm; Supplier 1: Digi-Key; Stock 1: 0; Pricing 1: 1=0.2, 10=0.184, 100=0.1274, 500=0.1078, 1000=0.0882, 5000=0.0784, 10000=0.071 (USD); Mount: Through Hole; Number of Pins: 3; Contact Material: Brass,Copper,Tin; Color: Natural,White; Contact Plating: Tin,Copper; Housing Color: Beige; Housing Material: Polyamide; Material: Nylon; Min Operating Temperature: -25°C; Max Operating Temperature: 85°C; Number of Rows: 1; Packaging: Bulk; Max Current Rating: 1A; Termination: Press-Fit; Fastening Type: Detent; Number of Contacts: 3; Max Voltage Rating (AC): 50V; Orientation: Right Angle; Voltage Rating (AC): 50V; Voltage Rating (DC): 50V; Length: 6mm; Height: 7.2mm; Width: 3.5mm; Depth: 6mm; Lead Pitch: 1.5mm; Contact Mating Length: 0.094inch; Lead Free: Lead Free; REACH SVHC: No SVHC; Flammability Rating: UL94 V-0; ComponentLink1URL: http://www.jst-mfg.com/product/pdf/eng/eZH.pdf?src-supplier=Digi-Key; ComponentLink1Description: http://www.jst-mfg.com/product/pdf/eng/eZH.pdf?src-supplier=Digi-Key; ComponentLink2URL: https://www.verical.com/server-webapp/html/getDatasheet?partID=722697&src-supplier=Verical; ComponentLink2Description: https://www.verical.com/server-webapp/html/getDatasheet?partID=722697&src-supplier=Verical; ComponentLink3URL: http://www.produktinfo.conrad.com/datenblaetter/725000-749999/741155-da-01-en-STIFTLEISTE_GEWINKELT_3_POL_RM1_5.pdf?src-supplier=Conrad; ComponentLink3Description: http://www.produktinfo.conrad.com/datenblaetter/725000-749999/741155-da-01-en-STIFTLEISTE_GEWINKELT_3_POL_RM1_5.pdf?src-supplier=Conrad; Supplier Part Number 1: 455-1670-ND
BM01 = CONN HEADER EC 6POS
CI03 CM01 CP01 = CAP CER 0.1uF ±10% 50V X7R 0603: as C01 on sheet MCU; Supplier 1: Digi-Key; Stock 1: 1202175; Pricing 1: 1=0.1, 10=0.039, 50=0.0204, 100=0.0174, 500=0.0124, 1000=0.0097 (USD); Mount: Surface Mount,PCB; Case/Package: 0603; Case Code (Metric): 1608; Case Code (Imperial): 0603; Contact Plating: Tin,Matte; Min Operating Temperature: -55°C; Max Operating Temperature: 125°C; Package Quantity: 1; Packaging: Tape and Reel; Voltage Rating (DC): 50V; Dielectric: X7R; Termination: SMD/SMT; Length: 1.6mm; Height: 0.8mm; Width: 0.031inch; Thickness: 0.034inch; Lead Pitch: 0.7mm; Depth: 0.8mm; Radiation Hardening: No; REACH SVHC: No SVHC; ComponentLink1URL: http://www.farnell.com/datasheets/2746056.pdf?src-supplier=Element14; ComponentLink1Description: http://www.farnell.com/datasheets/2746056.pdf?src-supplier=Element14; ComponentLink2URL: http://www.mouser.com/ds/2/212/KEM_C1002_X7R_SMD-1102033.pdf?src-supplier=Mouser; ComponentLink2Description: http://www.mouser.com/ds/2/212/KEM_C1002_X7R_SMD-1102033.pdf?src-supplier=Mouser; ComponentLink3URL: https://www.verical.com/server-webapp/html/getDatasheet?partID=626892&src-supplier=Verical; ComponentLink3Description: https://www.verical.com/server-webapp/html/getDatasheet?partID=626892&src-supplier=Verical; ComponentLink4URL: http://components.arrow.com/part/dataview/40911037S8853915N7429?src-supplier=Arrow; ComponentLink4Description: http://components.arrow.com/part/dataview/40911037S8853915N7429?src-supplier=Arrow; ComponentLink5URL: http://capacitoredge.kemet.com/capedge2/DataSheet?pn=C0603C104M5RAC7867&src-supplier=Avnet; ComponentLink5Description: http://capacitoredge.kemet.com/capedge2/DataSheet?pn=C0603C104M5RAC7867&src-supplier=Avnet; ComponentLink6URL: http://capacitoredge.kemet.com/capedge2/DataSheet?pn=C0603C104M5RAC7867&src-supplier=Avnet+Asia; ComponentLink6Description: http://capacitoredge.kemet.com/capedge2/DataSheet?pn=C0603C104M5RAC7867&src-supplier=Avnet+Asia; ComponentLink7URL: http://www.farnell.com/datasheets/2746056.pdf?src-supplier=Farnell; ComponentLink7Description: http://www.farnell.com/datasheets/2746056.pdf?src-supplier=Farnell; ComponentLink8URL: http://www.farnell.com/datasheets/2746056.pdf?src-supplier=Newark; ComponentLink8Description: http://www.farnell.com/datasheets/2746056.pdf?src-supplier=Newark; ComponentLink9URL: http://www.alliedelec.com/m/d/6f3b5eb83d09db50ed28bdc730567b33.pdf?src-supplier=Allied+Electronics; ComponentLink9Description: http://www.alliedelec.com/m/d/6f3b5eb83d09db50ed28bdc730567b33.pdf?src-supplier=Allied+Electronics; ComponentLink10URL: https://api.kemet.com/component-edge/download/datasheet/C0603C104M5RACTU.pdf?src-supplier=Digi-Key; ComponentLink10Description: https://api.kemet.com/component-edge/download/datasheet/C0603C104M5RACTU.pdf?src-supplier=Digi-Key; ComponentLink11URL: http://www.farnell.com/datasheets/2315113.pdf?src-supplier=Newark; ComponentLink11Description: http://www.farnell.com/datasheets/2315113.pdf?src-supplier=Newark; ComponentLink12URL: http://www.farnell.com/datasheets/1828800.pdf?src-supplier=Newark; ComponentLink12Description: http://www.farnell.com/datasheets/1828800.pdf?src-supplier=Newark; ComponentLink13URL: http://components.arrow.com/part/dataview/0323_00313986?src-supplier=Arrow+Europe; ComponentLink13Description: http://components.arrow.com/part/dataview/0323_00313986?src-supplier=Arrow+Europe; ComponentLink14URL: https://www.verical.com/server-webapp/html/getDatasheet?partID=110138&src-supplier=Verical; ComponentLink14Description: https://www.verical.com/server-webapp/html/getDatasheet?partID=110138&src-supplier=Verical; Supplier Part Number 1: 399-7845-1-ND
CI05 CP02 = CAP_CER_10000PF_100V_X7R_0603: 10000pF ±10% 100V Ceramic Capacitor X7R 0603 (1608 Metric); Manufacturer: Yageo; Link: https://www.digikey.com/product-detail/en/yageo/CC0603KRX7R0BB103/311-1788-1-ND/5195690; Digi-KeyPartNumber: 311-1788-1-ND; PartNumber: CC0603KRX7R0BB103
CP03 = CAP ALUM 100 UF 20% 6.3 V SMD: 100µF 6.3V Aluminum Electrolytic Capacitors Radial, Can - SMD  2000 Hrs @ 105°C; Manufacturer Part Number: 865080142007; Manufacturer: Wurth Elektronik; Dissipation Factor: 24%; Endurance: 2000h; Leakage Current: 6.3uA; Ripple Current: 170mA; Capacitance Tolerance: +/-20%; Technical Reference: ASEC055101M6R3DVCTBB000; Polarity: Polar; Impedance: 800mR; Life (Hours): 2000Hour; ComponentLink1Description: Manufacturer; ComponentLink1URL: http://www.we-online.de; ComponentLink2Description: Datasheet; ComponentLink2URL: https://www.we-online.com/catalog/datasheet/865080142007.pdf; Height: 5.5mm; Mounting Technology: SMT; Operating Temperature: -55 to +105degC; Packaging: Tape and Reel; Published Date: May 2020; Diameter: 5mm; Supplier 1: Digi-Key; Stock 1: 2227; Pricing 1: 1=0.2, 50=0.167, 100=0.145, 250=0.129, 500=0.113 (USD); Mount: Surface Mount; Case/Package: Radial; Min Operating Temperature: -55°C; Max Operating Temperature: 105°C; Package Quantity: 1000; Ripple Current (AC): 170mA; Tolerance: 20%; Voltage Rating (DC): 6.3V; Height - Seated (Max): 0.217inch; REACH SVHC: Unknown; ComponentLink3URL: http://www.farnell.com/datasheets/1880090.pdf?src-supplier=Farnell; ComponentLink3Description: http://www.farnell.com/datasheets/1880090.pdf?src-supplier=Farnell; ComponentLink4URL: http://www.farnell.com/datasheets/1880090.pdf?src-supplier=Newark; ComponentLink4Description: http://www.farnell.com/datasheets/1880090.pdf?src-supplier=Newark; ComponentLink5URL: http://katalog.we-online.de/pbs/datasheet/865080142007.pdf?src-supplier=Digi-Key; ComponentLink5Description: http://katalog.we-online.de/pbs/datasheet/865080142007.pdf?src-supplier=Digi-Key; ComponentLink6URL: http://www.farnell.com/datasheets/1880090.pdf?src-supplier=Element14; ComponentLink6Description: http://www.farnell.com/datasheets/1880090.pdf?src-supplier=Element14; ComponentLink7URL: https://katalog.we-online.de/pbs/datasheet/865080142007.pdf?src-supplier=Digi-Key; ComponentLink7Description: https://katalog.we-online.de/pbs/datasheet/865080142007.pdf?src-supplier=Digi-Key; Supplier Part Number 1: 732-8472-1-ND
CP04 CP05 = CAP CER 4.7UF 50V X5R 0805: 4.7µF ±10% 50V Ceramic Capacitor X5R 0805 (2012 Metric); Manufacturer: Samsung; Manufacturer Part Number: CL21A475KBQNNNE; Supplier 1: Digi-Key; Stock 1: 896091; Pricing 1: 1=0.27, 10=0.184, 50=0.1224, 100=0.1041, 500=0.0735, 1000=0.0643 (USD); Mount: Surface Mount; Case/Package: 0805; Case Code (Metric): 2012; Case Code (Imperial): 0805; Min Operating Temperature: -55°C; Max Operating Temperature: 85°C; Tolerance: 10%; Package Quantity: 1; Packaging: Tape and Reel; Dielectric: X5R; Length: 2mm; Width: 0.049inch; Thickness: 0.055inch; Depth: 1.25mm; Radiation Hardening: No; ComponentLink1URL: http://www.samsungsem.com/kr/support/product-search/mlcc/CL21A475KBQNNNE.jsp?src-supplier=Digi-Key; ComponentLink1Description: http://www.samsungsem.com/kr/support/product-search/mlcc/CL21A475KBQNNNE.jsp?src-supplier=Digi-Key; ComponentLink2URL: https://www.verical.com/server-webapp/html/getDatasheet?partID=470982&src-supplier=Verical; ComponentLink2Description: https://www.verical.com/server-webapp/html/getDatasheet?partID=470982&src-supplier=Verical; ComponentLink3URL: http://www1.futureelectronics.com/doc/SAMSUNG/CL21A475KBQNNNE.pdf?src-supplier=Future+Electronics; ComponentLink3Description: http://www1.futureelectronics.com/doc/SAMSUNG/CL21A475KBQNNNE.pdf?src-supplier=Future+Electronics; Supplier Part Number 1: 1276-1248-1-ND
D01 = BAT54: Schottky DiodeS
DP01 = BAT54A: 410mV Forward, 70v Reverse, 1A/250mW Series Schottky Diode
QI01 = BC857BW: Bipolar (BJT) Transistor PNP
QI02 QI03 QI04 = TRANS BC847CW,115 NPN 45V 0.1A SOT323: Bipolar (BJT) Transistor NPN 45V 100mA 100MHz 200mW Surface Mount SOT-323-3; Manufacturer: Nexperia; Supplier 1: Digi-Key; Manufacturer Part Number: BC847CW,115; Stock 1: 327256; Pricing 1: 1=0.13, 10=0.118, 25=0.1124, 100=0.0495, 250=0.0475, 500=0.0389, 1000=0.027 (USD); ComponentLink1URL: http://www.farnell.com/datasheets/1856333.pdf?src-supplier=Farnell; ComponentLink1Description: http://www.farnell.com/datasheets/1856333.pdf?src-supplier=Farnell; ComponentLink2URL: http://www.farnell.com/datasheets/1856333.pdf?src-supplier=Element14; ComponentLink2Description: http://www.farnell.com/datasheets/1856333.pdf?src-supplier=Element14; ComponentLink3URL: https://assets.nexperia.com/documents/data-sheet/BC847_SER.pdf?src-supplier=Digi-Key; ComponentLink3Description: https://assets.nexperia.com/documents/data-sheet/BC847_SER.pdf?src-supplier=Digi-Key; ComponentLink4URL: http://www.farnell.com/datasheets/1856333.pdf?src-supplier=Newark; ComponentLink4Description: http://www.farnell.com/datasheets/1856333.pdf?src-supplier=Newark; Supplier Part Number 1: 1727-4312-1-ND
RI01 = R 47Ω ±1% 0603 0.1W: Resistor; Manufacturer: Yageo; Manufacturer Part Number: AC0603FR-0747RL; Temperature Coefficient: 100ppm/°C; Power Rating: 100mW; Voltage Rating: 50V; Supplier 1: Digi-Key; Stock 1: 51634; Pricing 1: 1=0.1, 10=0.029, 100=0.0118, 1000=0.0053, 2500=0.0046 (USD); Case/Package: 0603; Weight: 7.1E-05oz; Case Code (Metric): 1608; Case Code (Imperial): 0603; Min Operating Temperature: -55°C; Max Operating Temperature: 155°C; Packaging: Tape and Reel; Composition: Thick Film; Number of Terminations: 2; Max Power Dissipation: 100mW; Package Quantity: 1; Termination: SMD/SMT; Features: Moisture Resistant,Automotive AEC-Q200,Anti-Sulfur; Length: 0.063inch; Height: 0.022inch; Width: 0.031inch; Lead Free: Lead Free; ComponentLink1URL: http://www.yageo.com/NewPortal/yageodocoutput?fileName=/pdf/R-Chip/PYu-AC_51_RoHS_L_6.pdf&src-supplier=Mouser; ComponentLink1Description: http://www.yageo.com/NewPortal/yageodocoutput?fileName=/pdf/R-Chip/PYu-AC_51_RoHS_L_6.pdf&src-supplier=Mouser; Supplier Part Number 1: 311-47LDCT-ND
RI02 RI03 RI05 RI08 RI09-RI11 = RES SMD 10K OHM 1% 1/10W 0603: 10 kOhms ±1% 0.1W, 1/10W Chip Resistor 0603 (1608 Metric)  Thick Film; Manufacturer: Yageo; Manufacturer Part Number: RC0603FR-0710KL; Temperature Coefficient: 100ppm/°C; Voltage Rating: 75V; Power Rating: 100mW; Voltage Rating (DC): 50V; Supplier 1: Digi-Key; Stock 1: 81498627; Pricing 1: 1=0.1, 10=0.024, 100=0.0097, 1000=0.0044, 2500=0.0038 (USD); Case/Package: 0603; Number of Pins: 2; Weight: 7.1E-05oz; Case Code (Imperial): 0603; Case Code (Metric): 1608; Min Operating Temperature: -55°C; Max Operating Temperature: 155°C; Packaging: Tape and Reel; Composition: Thick Film; Military Standard: Not; Termination: SMD/SMT; Length: 1.6mm; Height: 0.45mm; Width: 0.8mm; Depth: 0.8mm; Lead Pitch: 0.3mm; Lead Free: Lead Free; REACH SVHC: No SVHC; ComponentLink1URL: http://www.farnell.com/datasheets/38590.pdf?src-supplier=Element14; ComponentLink1Description: http://www.farnell.com/datasheets/38590.pdf?src-supplier=Element14; ComponentLink2URL: https://www.verical.com/server-webapp/html/getDatasheet?partID=409289&src-supplier=Verical; ComponentLink2Description: https://www.verical.com/server-webapp/html/getDatasheet?partID=409289&src-supplier=Verical; ComponentLink3URL: http://www.farnell.com/datasheets/1868787.pdf?src-supplier=Element14; ComponentLink3Description: http://www.farnell.com/datasheets/1868787.pdf?src-supplier=Element14; ComponentLink4URL: http://www.farnell.com/datasheets/2167052.pdf?src-supplier=Element14; ComponentLink4Description: http://www.farnell.com/datasheets/2167052.pdf?src-supplier=Element14; ComponentLink5URL: http://www.farnell.com/datasheets/443971.pdf?src-supplier=Element14; ComponentLink5Description: http://www.farnell.com/datasheets/443971.pdf?src-supplier=Element14; Supplier Part Number 1: 311-10.0KHRCT-ND
RI04 = RES SMD 1.47K OHM 1% 1/10W 0603: 1.47 kOhms ±1% 0.1W, 1/10W Chip Resistor 0603 (1608 Metric)  Thick Film; Manufacturer: Yageo; Manufacturer Part Number: RC0603FR-071K47L; Max Power Dissipation: 100mW; Temperature Coefficient: 100ppm/°C; Voltage Rating (DC): 50V; Voltage Rating: 75V; Supplier 1: Digi-Key; Stock 1: 354350; Pricing 1: 1=0.1, 10=0.021, 100=0.0085, 1000=0.0038, 2500=0.0033 (USD); Case/Package: 0603; Case Code (Metric): 1608; Case Code (Imperial): 0603; Min Operating Temperature: -55°C; Max Operating Temperature: 155°C; Packaging: Tape and Reel; Number of Terminations: 2; Package Quantity: 1; Features: Moisture Resistant; Power Rating: 100mW; Military Standard: Not; Length: 1.6mm; Height: 0.022inch; Width: 0.8mm; Depth: 0.8mm; Lead Free: Lead Free; ComponentLink1URL: http://www.yageo.com/documents/recent/PYu-RC_Group_51_RoHS_L_9.pdf?src-supplier=Digi-Key; ComponentLink1Description: http://www.yageo.com/documents/recent/PYu-RC_Group_51_RoHS_L_9.pdf?src-supplier=Digi-Key; ComponentLink2URL: http://www.yageo.com/documents/recent/PYu-RC_Group_51_RoHS_L_10.pdf?src-supplier=Digi-Key; ComponentLink2Description: http://www.yageo.com/documents/recent/PYu-RC_Group_51_RoHS_L_10.pdf?src-supplier=Digi-Key; Supplier Part Number 1: 311-1.47KHRCT-ND; Weight: 7.1E-05oz; Resistor Type: Thick Film; Termination: SMD/SMT; Mount: Surface Mount
RI06 = R 2.2kΩ ±1% 0603 0.1W: Resistor; Manufacturer: Yageo; Manufacturer Part Number: AC0603FR-072K2L; Temperature Coefficient: 100ppm/°C; Voltage Rating: 50V; Power Rating: 100mW; Supplier 1: Digi-Key; Stock 1: 604704; Pricing 1: 1=0.1, 10=0.029, 100=0.0118, 1000=0.0053, 2500=0.0046 (USD); Case/Package: 0603; Case Code (Imperial): 0603; Case Code (Metric): 1608; Min Operating Temperature: -55°C; Max Operating Temperature: 155°C; Packaging: Tape and Reel; Composition: Thick Film; Military Standard: Not; Termination: SMD/SMT; Length: 0.063inch; Height: 0.022inch; Width: 0.031inch; Depth: 0.8mm; Lead Free: Lead Free; ComponentLink1URL: http://www.yageo.com/NewPortal/yageodocoutput?fileName=/pdf/R-Chip/PYu-AC_51_RoHS_L_6.pdf&src-supplier=Mouser; ComponentLink1Description: http://www.yageo.com/NewPortal/yageodocoutput?fileName=/pdf/R-Chip/PYu-AC_51_RoHS_L_6.pdf&src-supplier=Mouser; Supplier Part Number 1: 311-2.2KLDCT-ND; Package Quantity: 1; Number of Terminations: 2; Max Power Dissipation: 100mW; Features: Moisture Resistant,Automotive AEC-Q200,Anti-Sulfur
RI07 = RES SMD 7.5K OHM 1% 1/10W 0603: 7.5 kOhms ±1% 0.1W, 1/10W Chip Resistor 0603 (1608 Metric) Moisture Resistant Thick Film; Manufacturer: Yageo; Manufacturer Part Number: RC0603FR-077K5L; Temperature Coefficient: 100ppm/°C; Voltage Rating: 50V; Power Rating: 100mW; Working Voltage: 75V; Supplier 1: Digi-Key; Stock 1: 1778854; Pricing 1: 1=0.1, 10=0.023, 100=0.0094, 1000=0.0042, 2500=0.0037 (USD); Case/Package: 0603; Number of Pins: 2; Case Code (Imperial): 0603; Case Code (Metric): 1608; Min Operating Temperature: -55°C; Max Operating Temperature: 155°C; Packaging: Tape and Reel; Composition: Thick Film; Military Standard: Not; Termination: SMD/SMT; Voltage Rating (DC): 50V; Length: 1.6mm; Height: 0.45mm; Width: 0.031inch; Depth: 0.8mm; Lead Free: Lead Free; REACH SVHC: No SVHC; ComponentLink1URL: http://www.yageo.com/documents/recent/PYu-RC_Group_51_RoHS_L_10.pdf?src-supplier=Digi-Key; ComponentLink1Description: http://www.yageo.com/documents/recent/PYu-RC_Group_51_RoHS_L_10.pdf?src-supplier=Digi-Key; ComponentLink2URL: http://www.mouser.com/catalog/specsheets/RC0603.pdf?src-supplier=Mouser; ComponentLink2Description: http://www.mouser.com/catalog/specsheets/RC0603.pdf?src-supplier=Mouser; ComponentLink3URL: http://www.farnell.com/datasheets/443971.pdf?src-supplier=Element14; ComponentLink3Description: http://www.farnell.com/datasheets/443971.pdf?src-supplier=Element14; ComponentLink4URL: https://www.verical.com/server-webapp/html/getDatasheet?partID=326523&src-supplier=Verical; ComponentLink4Description: https://www.verical.com/server-webapp/html/getDatasheet?partID=326523&src-supplier=Verical; Supplier Part Number 1: 311-7.50KHRCT-ND; Package Quantity: 1; Number of Terminations: 2; Max Power Dissipation: 100mW; Features: Moisture Resistant
RM01 RM02 RM03 = R 4.7kΩ ±1% 0603 0.1W: Resistor; Manufacturer: Yageo; Manufacturer Part Number: AC0603FR-074K7L; Temperature Coefficient: 100ppm/°C; Power Rating: 100mW; Voltage Rating: 50V; Supplier 1: Digi-Key; Stock 1: 568000; Pricing 1: 1=0.1, 10=0.029, 100=0.0118, 1000=0.0053, 2500=0.0046 (USD); Case/Package: 0603; Case Code (Imperial): 0603; Case Code (Metric): 1608; Min Operating Temperature: -55°C; Max Operating Temperature: 155°C; Packaging: Tape and Reel; Composition: Thick Film; Military Standard: Not; Termination: SMD/SMT; Number of Terminations: 2; Max Power Dissipation: 100mW; Features: Moisture Resistant,Automotive AEC-Q200; Length: 0.063inch; Height: 0.022inch; Width: 0.031inch; Depth: 0.8mm; Lead Free: Lead Free; Supplier Part Number 1: YAG3613CT-ND
RM04 RM05 RM06 RM07 = RES_SMD_100_OHM_1%_1/8W_0603: RES SMD 100 OHM 1% 1/8W 0603; PartNumber: MCT06030C1000FP500; Manufacturer: Vishay Beyschlag; Link: https://www.digikey.com/product-detail/en/vishay-beyschlag/MCT06030C1000FP500/MCT0603-100-CFCT-ND/2607874; Digi-KeyPartNumber: MCT0603-100-CFCT-ND; Value: 100 Ohms
UM01 = IC 25P80VG FLASH 8MBIT SPI 75MHZ 8SO